# Altium schematic sheet 02_HDMI.SchDoc
size A; SheetNumber: 3; SheetTotal: 5
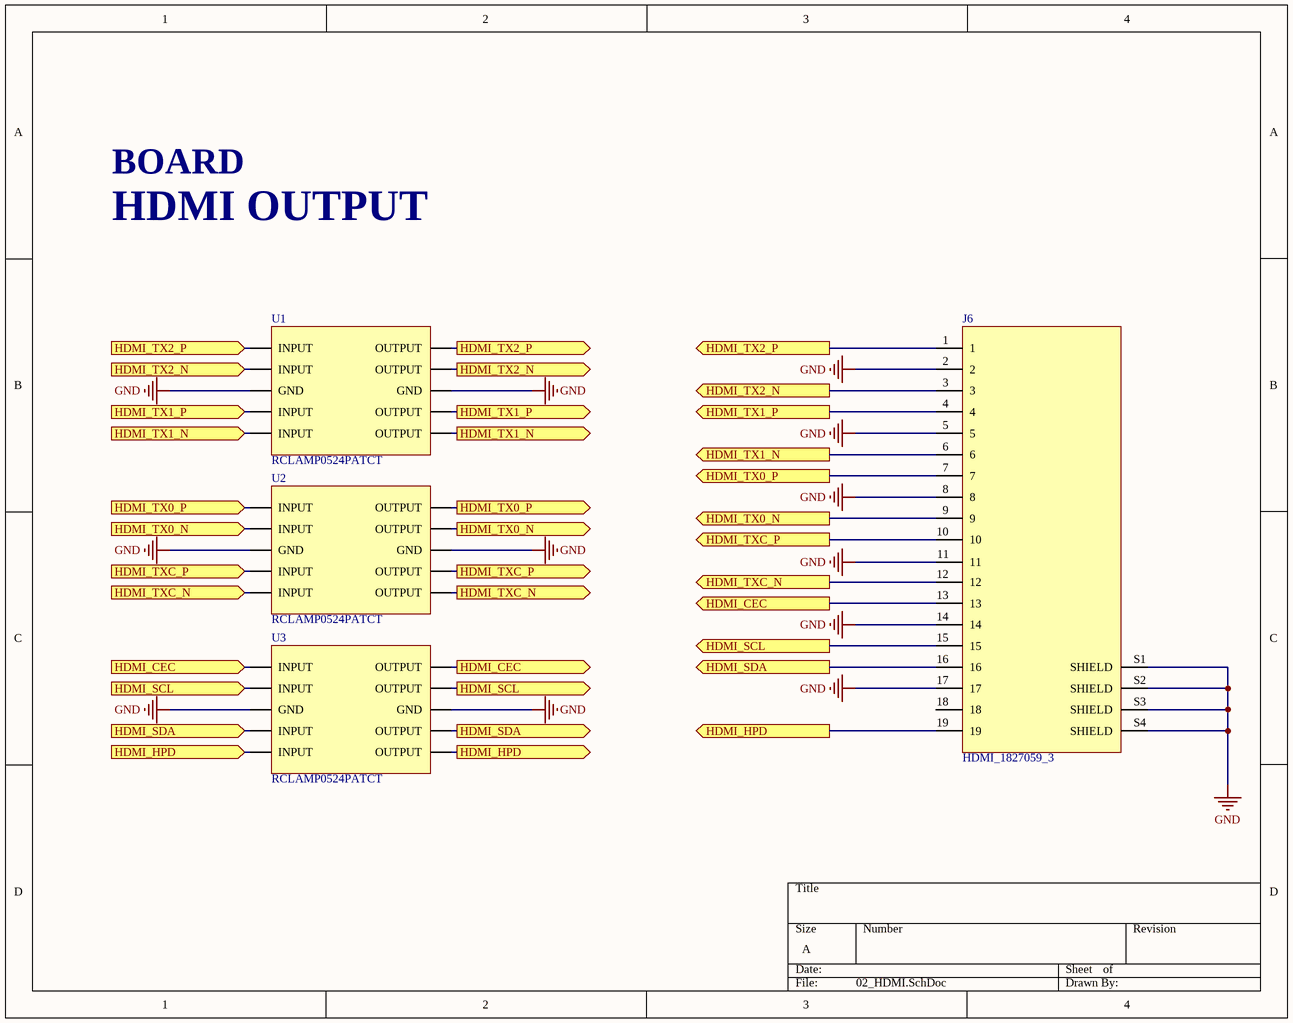
[diagram p0: 02_HDMI.SchDoc]

## Parts
J6  HDMI_1827059_3  [HDMI_1827059_3]
U1  RCLAMP0524PATCT  [RCLAMP0524PATCT]
U2  RCLAMP0524PATCT  [RCLAMP0524PATCT]
U3  RCLAMP0524PATCT  [RCLAMP0524PATCT]

## Ports
HDMI_CEC (in), HDMI_CEC (out), HDMI_HPD (in), HDMI_HPD (out), HDMI_SCL (in), HDMI_SCL (out), HDMI_SDA (in), HDMI_SDA (out), HDMI_TX0_N (in), HDMI_TX0_N (out), HDMI_TX0_P (in), HDMI_TX0_P (out), HDMI_TX1_N (in), HDMI_TX1_N (out), HDMI_TX1_P (in), HDMI_TX1_P (out), HDMI_TX2_N (in), HDMI_TX2_N (out), HDMI_TX2_P (in), HDMI_TX2_P (out), HDMI_TXC_N (in), HDMI_TXC_N (out), HDMI_TXC_P (in), HDMI_TXC_P (out)

## Nets
GND: J6.2 J6.5 J6.8 J6.11 J6.14 J6.17 J6.S1(SHIELD) J6.S2(SHIELD) J6.S3(SHIELD) J6.S4(SHIELD) U1.3(GND) U1.8(GND) U2.3(GND) U2.8(GND) U3.3(GND) U3.8(GND)
HDMI_CEC: J6.13 U3.1(INPUT) U3.10(OUTPUT) ; port HDMI_CEC
HDMI_HPD: J6.19 U3.5(INPUT) U3.6(OUTPUT) ; port HDMI_HPD
HDMI_SCL: J6.15 U3.2(INPUT) U3.9(OUTPUT) ; port HDMI_SCL
HDMI_SDA: J6.16 U3.4(INPUT) U3.7(OUTPUT) ; port HDMI_SDA
HDMI_TX0_N: J6.9 U2.2(INPUT) U2.9(OUTPUT) ; port HDMI_TX0_N
HDMI_TX0_P: J6.7 U2.1(INPUT) U2.10(OUTPUT) ; port HDMI_TX0_P
HDMI_TX1_N: J6.6 U1.5(INPUT) U1.6(OUTPUT) ; port HDMI_TX1_N
HDMI_TX1_P: J6.4 U1.4(INPUT) U1.7(OUTPUT) ; port HDMI_TX1_P
HDMI_TX2_N: J6.3 U1.2(INPUT) U1.9(OUTPUT) ; port HDMI_TX2_N
HDMI_TX2_P: J6.1 U1.1(INPUT) U1.10(OUTPUT) ; port HDMI_TX2_P
HDMI_TXC_N: J6.12 U2.5(INPUT) U2.6(OUTPUT) ; port HDMI_TXC_N
HDMI_TXC_P: J6.10 U2.4(INPUT) U2.7(OUTPUT) ; port HDMI_TXC_P

Not connected (* = marked no-connect by the designer): J6 18

## Notes on the sheet
- BOARD
- HDMI OUTPUT